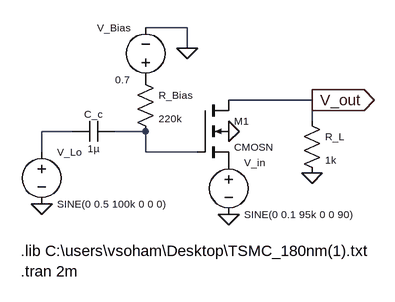
[diagram p0: schematic AEC_Project_Mixer and Passive LPF.asc]
AEC_Project_Mixer and Passive LPF.asc, the LTspice schematic file:
Version 4
SHEET 1 880 680
WIRE -144 32 -208 32
WIRE -144 64 -144 32
WIRE 48 144 -80 144
WIRE 48 176 48 144
WIRE -320 192 -368 192
WIRE -208 192 -256 192
WIRE -368 224 -368 192
WIRE -208 224 -208 192
WIRE -128 224 -208 224
FLAG -144 64 0
FLAG -368 304 0
FLAG -80 320 0
FLAG -80 192 0
FLAG 48 256 0
FLAG 48 144 V_out
IOPIN 48 144 Out
SYMBOL nmos4 -128 144 R0
WINDOW 0 56 32 Left 1
WINDOW 3 56 72 Left 1
SYMATTR InstName M1
SYMATTR Value CMOSN
SYMATTR Value2 l=0.18u w=1.8u ad=0.81p as=0.81p pd=4.5u ps=4.5u
SYMBOL voltage -368 208 R0
WINDOW 123 0 0 Left 0
WINDOW 39 0 0 Left 0
WINDOW 0 24 16 Left 1
WINDOW 3 24 96 Left 1
SYMATTR InstName V_Lo
SYMATTR Value SINE(0 0.5 100k 0 0 0)
SYMBOL voltage -80 224 R0
WINDOW 123 0 0 Left 0
WINDOW 39 0 0 Left 0
WINDOW 0 24 16 Left 1
WINDOW 3 24 96 Left 1
SYMATTR InstName V_in
SYMATTR Value SINE(0 0.1 95k 0 0 90)
SYMBOL voltage -208 128 R180
WINDOW 0 24 96 Left 1
WINDOW 3 24 16 Left 1
WINDOW 123 0 0 Left 0
WINDOW 39 0 0 Left 0
SYMATTR InstName V_Bias
SYMATTR Value 0.7
SYMBOL cap -256 176 R90
WINDOW 0 0 32 VBottom 1
WINDOW 3 32 32 VTop 1
SYMATTR InstName C_c
SYMATTR Value 1µ
SYMBOL res -224 96 R0
WINDOW 0 36 40 Left 1
WINDOW 3 36 76 Left 1
SYMATTR InstName R_Bias
SYMATTR Value 220k
SYMBOL res 32 160 R0
WINDOW 0 36 40 Left 1
WINDOW 3 36 76 Left 1
SYMATTR InstName R_L
SYMATTR Value 1k
TEXT -400 408 Left 2 !.tran 2m
TEXT -400 376 Left 2 !.lib C:\\users\\vsoham\\Desktop\\TSMC_180nm(1).txt

The netlist it stands for:
* AEC_Project_Mixer and Passive LPF.asc
M1 V_out N002 P001 0 CMOSN l=0.18u w=1.8u ad=0.81p as=0.81p pd=4.5u ps=4.5u
V_Lo N001 0 SINE(0 0.5 100k 0 0 0)
V_in P001 0 SINE(0 0.1 95k 0 0 90)
V_Bias P002 0 0.7
C_c N002 N001 1µ
R_Bias P002 N002 220k
R_L V_out 0 1k
.model NMOS NMOS
.model PMOS PMOS
.lib standard.mos
.tran 2m
.lib C:\users\vsoham\Desktop\TSMC_180nm(1).txt
.backanno
.end